# Altium schematic sheet rf_router_main.SchDoc: mcHF Pro Transceiver RF board
size A3; Author: Krassi Atanassov; CompanyName: MØNKA; Engineer: For radio amateurs experimentation, non-commercial use only. Thank you!; Revision: 0.8.2; SheetTotal: 14
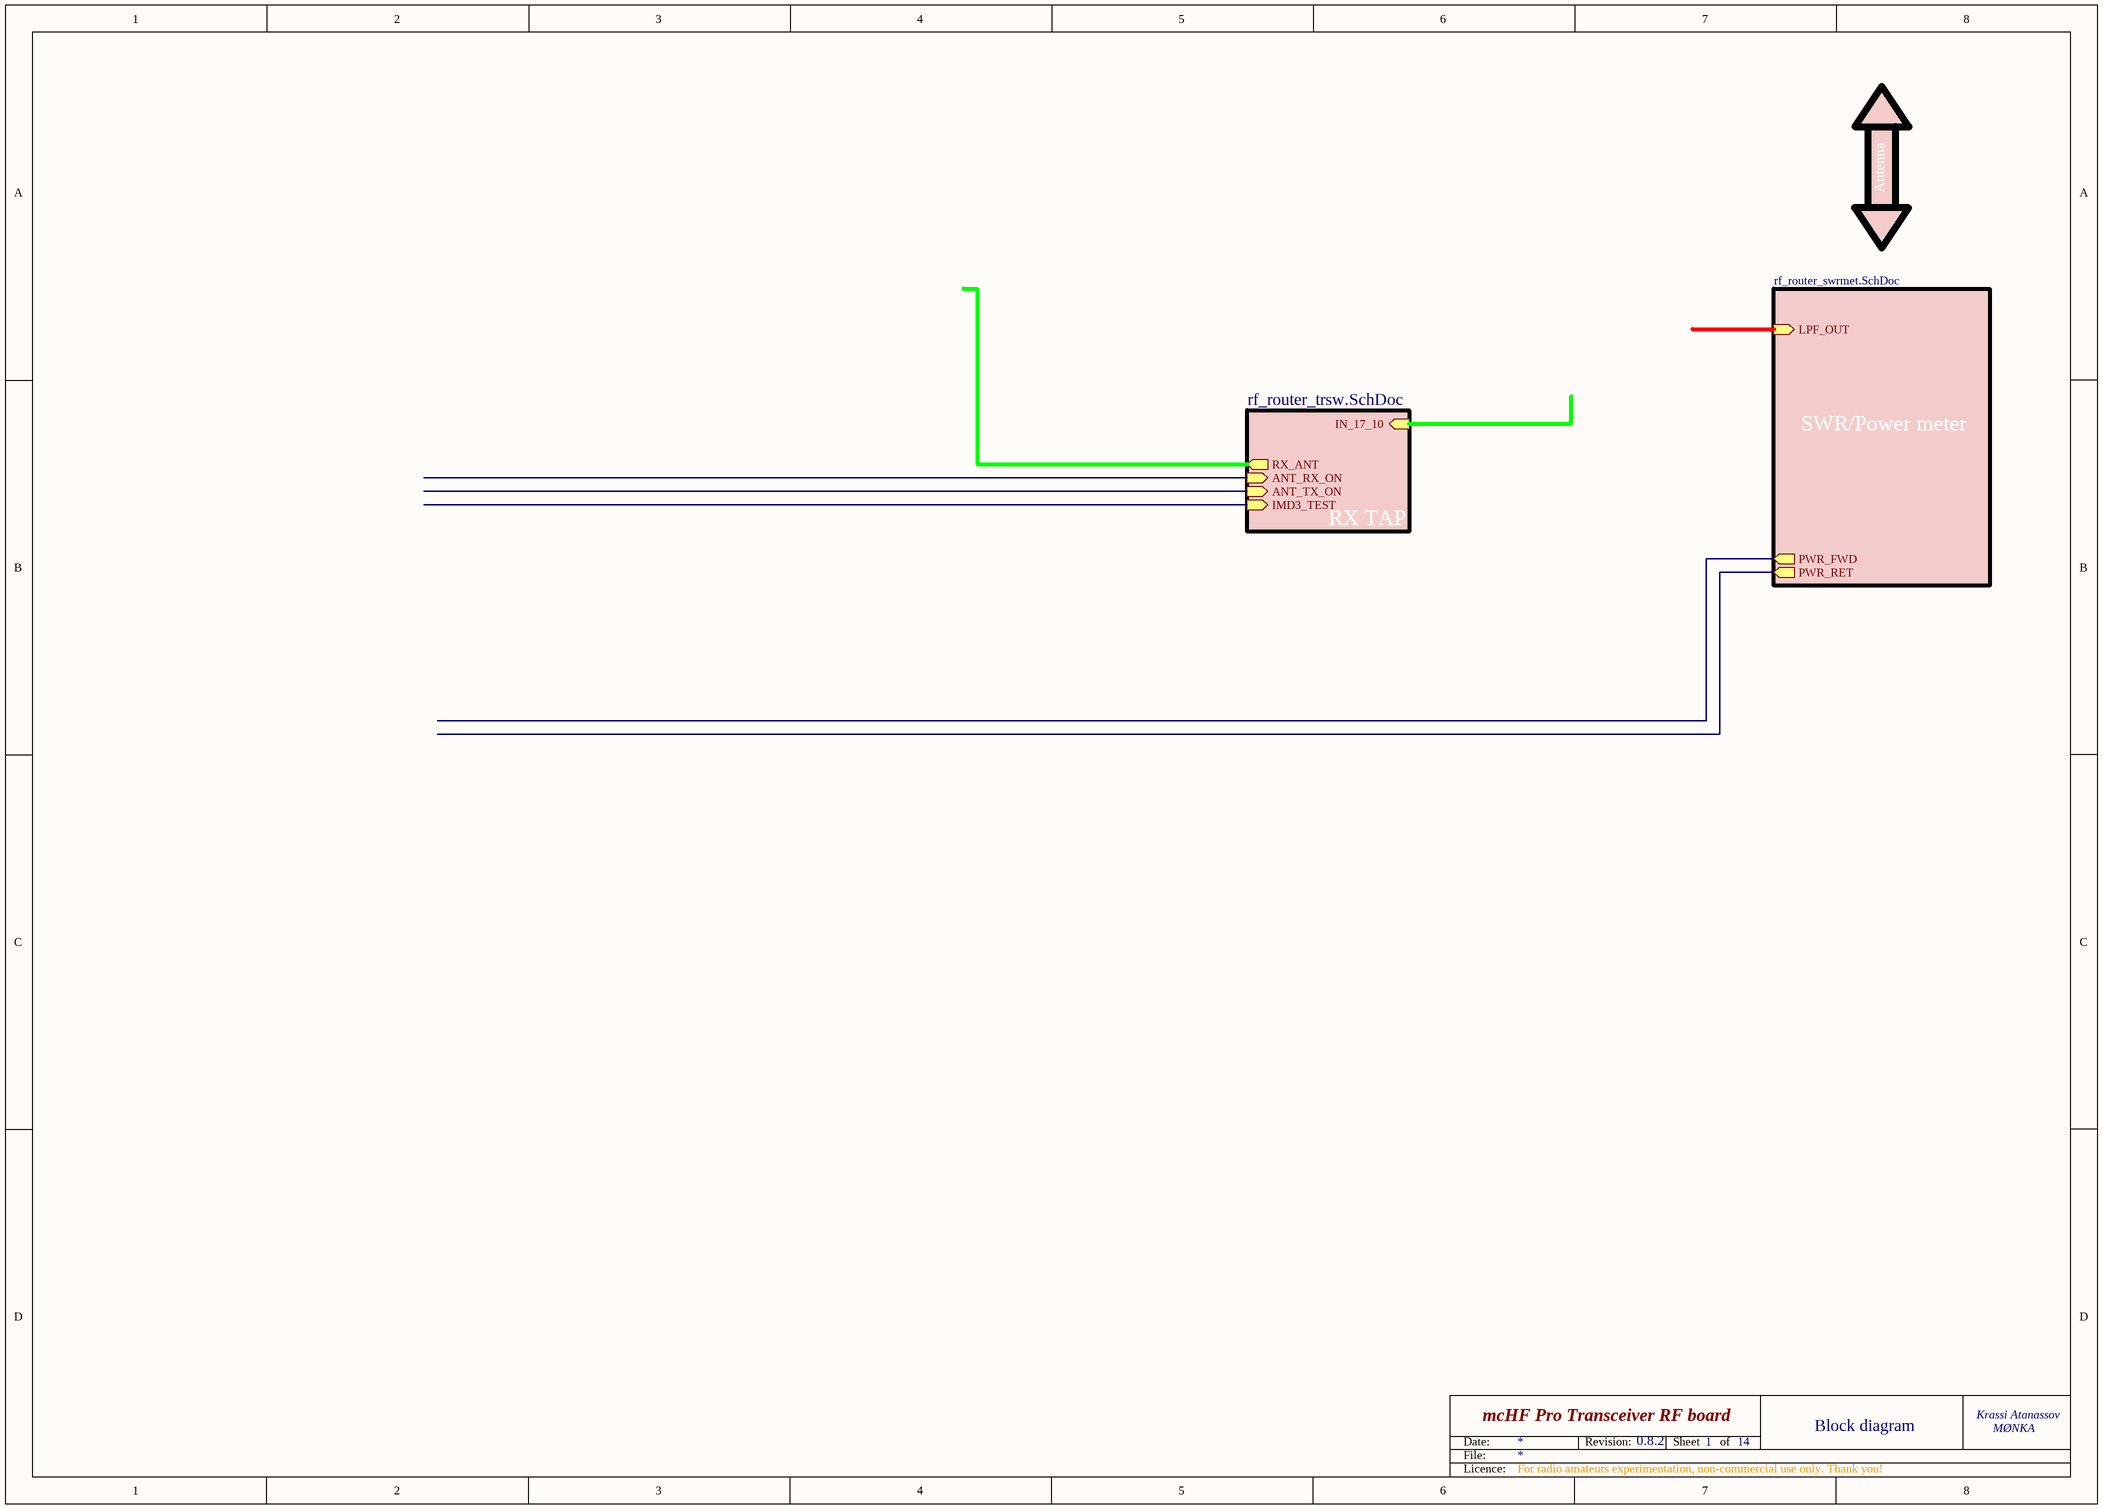
[diagram p0: rf_router_main.SchDoc]

## Sub-sheets
RX TAP = rf_router_trsw.SchDoc: RX_ANT (out), ANT_RX_ON (in), ANT_TX_ON (in), IN_17_10 (in), IMD3_TEST (in)
SWR/Power meter = rf_router_swrmet.SchDoc: LPF_OUT (in), PWR_FWD (out), PWR_RET (out)

## Notes on the sheet
- Antenna
- 1
- Block diagram
- Date:
- File:
- Revision:
- Sheet
- of
- Licence: